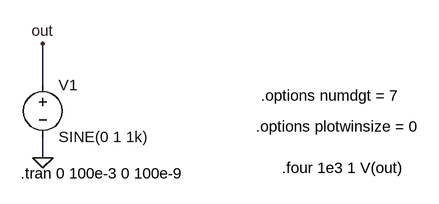
[diagram p0: schematic fft.asc]
fft.asc, the LTspice schematic file:
Version 4
SHEET 1 880 680
WIRE 96 144 96 80
WIRE 96 256 96 224
FLAG 96 256 0
FLAG 96 80 out
SYMBOL voltage 96 128 R0
WINDOW 123 0 0 Left 2
WINDOW 39 0 0 Left 2
SYMATTR InstName V1
SYMATTR Value SINE(0 1 1k)
TEXT 62 280 Left 2 !.tran 0 100e-3 0 100e-9
TEXT 432 160 Left 2 !.options numdgt = 7
TEXT 424 208 Left 2 !.options plotwinsize = 0
TEXT 464 272 Left 2 !.four 1e3 1 V(out)

The netlist it stands for:
* fft.asc
V1 out 0 SINE(0 1 1k)
.tran 0 100e-3 0 100e-9
.options numdgt = 7
.options plotwinsize = 0
.four 1e3 1 V(out)
.backanno
.end